# EAGLE design Sun Trcker (EAGLE 9.6.2)
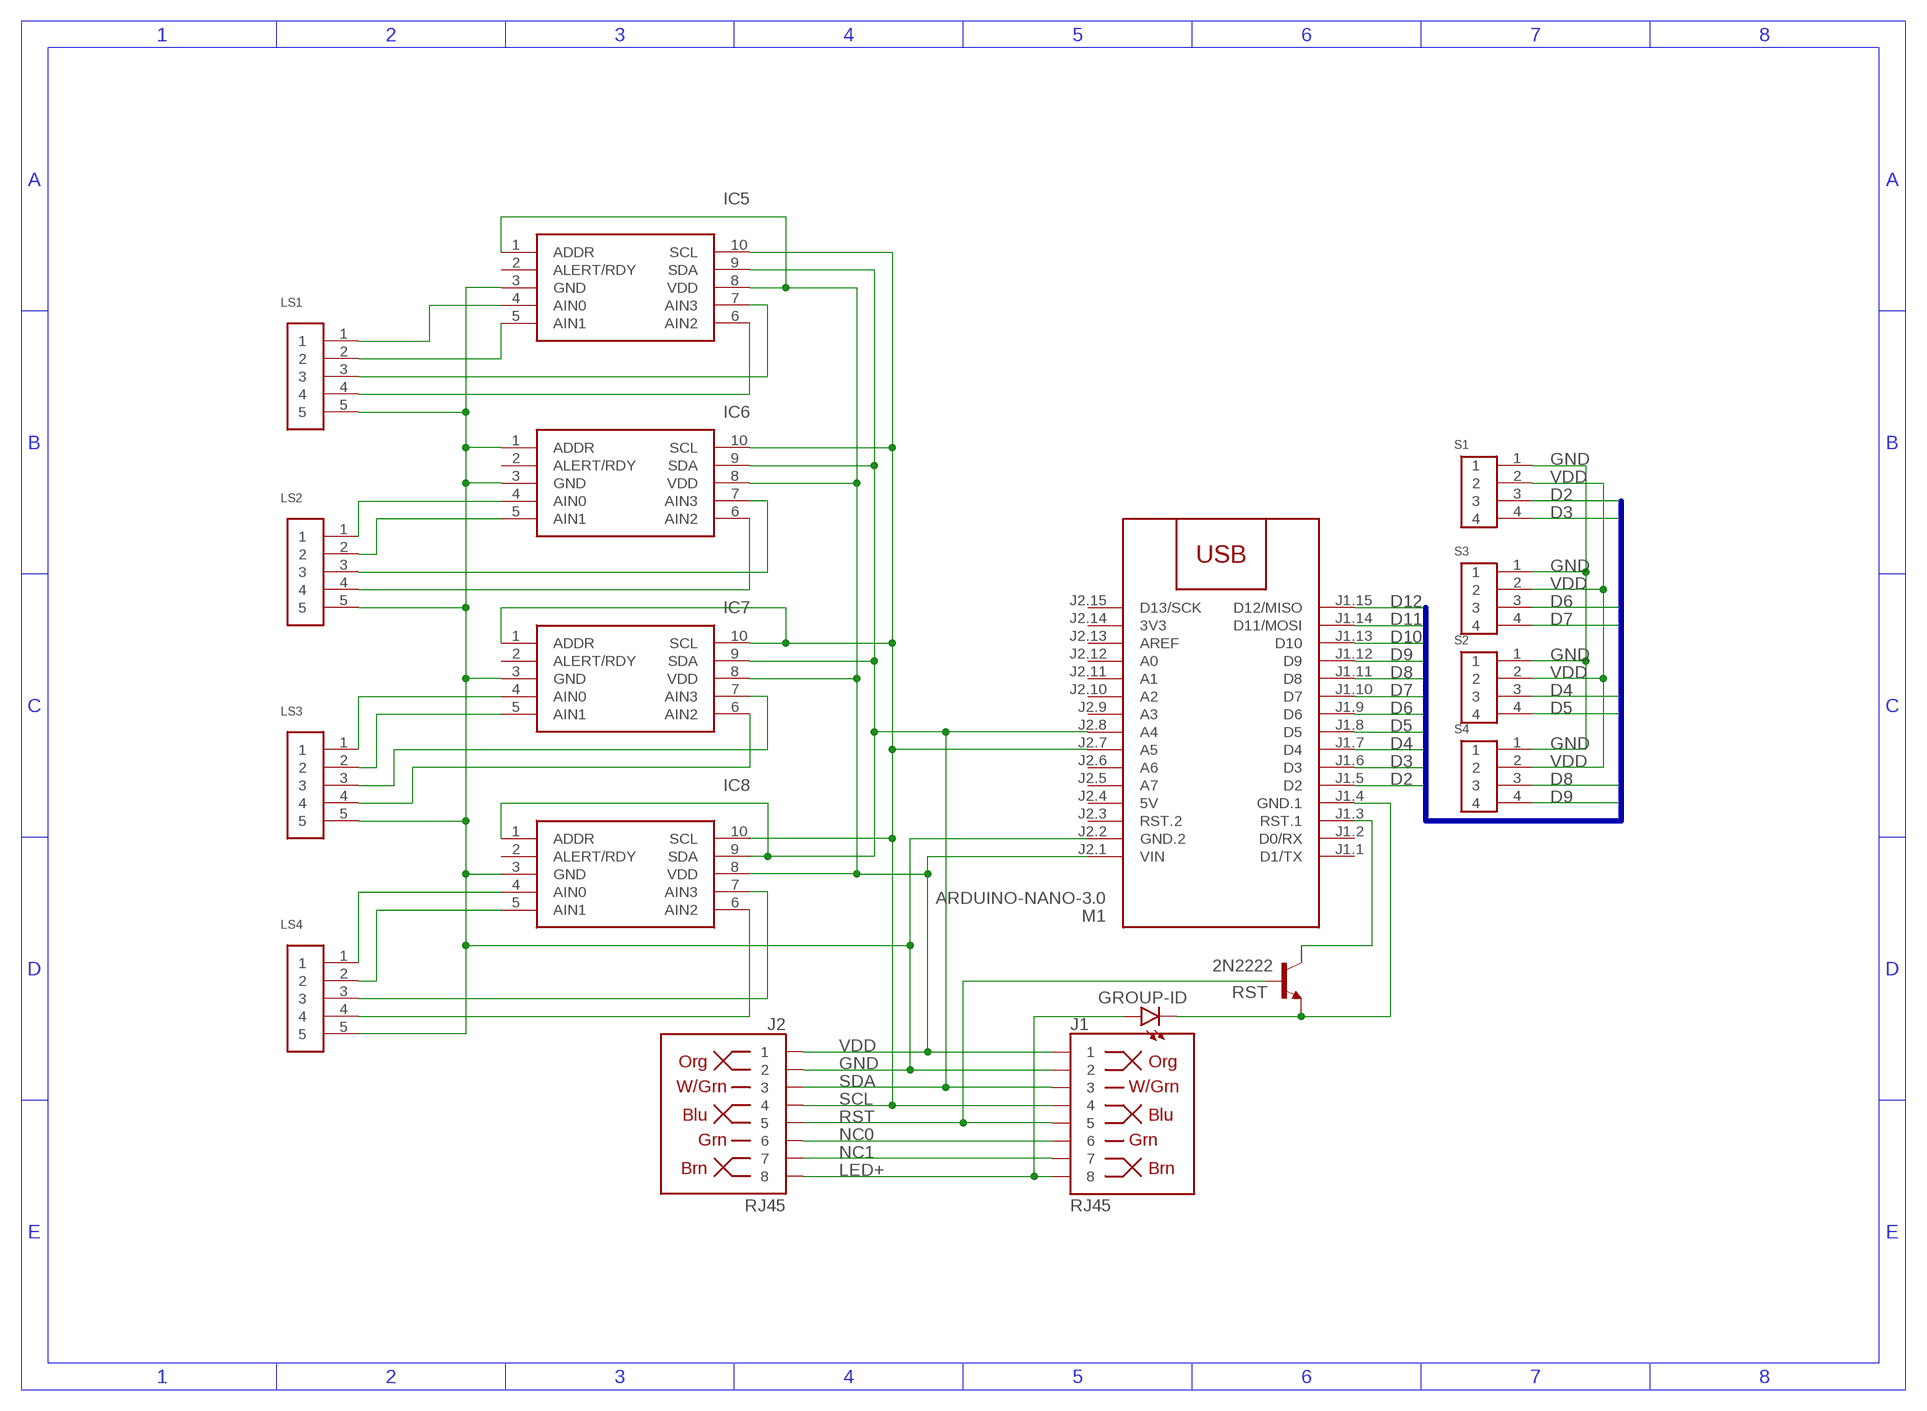
[diagram p0: schematic, sheet 1]

## Parts
GROUP-ID  LED_BLUE  LED_RADIAL_BLUE  [LEDRD254W60D565H860B_B]
IC5  ADS1115IDGST  [SOP50P490X110-10N]
IC6  ADS1115IDGST  [SOP50P490X110-10N]
IC7  ADS1115IDGST  [SOP50P490X110-10N]
IC8  ADS1115IDGST  [SOP50P490X110-10N]
J1  RJ45  RJ45-8  [RJ45-8]
J2  RJ45  RJ45-8  [RJ45-8]
LS1  S5B-EH(LF)(SN)  [S5B-EH(LF)(SN)]
LS2  S5B-EH(LF)(SN)  [S5B-EH(LF)(SN)]
LS3  S5B-EH(LF)(SN)  [S5B-EH(LF)(SN)]
LS4  S5B-EH(LF)(SN)  [S5B-EH(LF)(SN)]
M1  ARDUINO-NANO-3.0  [ARDUINO-NANO-3.0]
RST  2N2222  [TO18]
S1  B4B-XH-A(LF)(SN)  [B4B-XH-A(LF)(SN)]
S2  B4B-XH-A(LF)(SN)  [B4B-XH-A(LF)(SN)]
S3  B4B-XH-A(LF)(SN)  [B4B-XH-A(LF)(SN)]
S4  B4B-XH-A(LF)(SN)  [B4B-XH-A(LF)(SN)]

## Nets
D2: M1.J1.5(D2) S1.3
D3: M1.J1.6(D3) S1.4
D4: M1.J1.7(D4) S2.3
D5: M1.J1.8(D5) S2.4
D6: M1.J1.9(D6) S3.3
D7: M1.J1.10(D7) S3.4
D8: M1.J1.11(D8) S4.3
D9: M1.J1.12(D9) S4.4
D10: M1.J1.13(D10)
D11: M1.J1.14(D11/MOSI)
D12: M1.J1.15(D12/MISO)
GND: IC5.3(GND) IC6.1(ADDR) IC6.3(GND) IC7.3(GND) IC8.3(GND) J1.2 J2.2 LS1.5 LS2.5 LS3.5 LS4.5 M1.J2.2(GND.2) S1.1 S2.1 S3.1 S4.1
LED+: GROUP-ID.1(A) J1.8 J2.8
N$7: IC5.4(AIN0) LS1.1
N$8: IC5.5(AIN1) LS1.2
N$9: IC5.7(AIN3) LS1.3
N$10: IC5.6(AIN2) LS1.4
N$11: GROUP-ID.2(C) M1.J1.4(GND.1) RST.1(E)
N$16: IC6.4(AIN0) LS2.1
N$21: M1.J1.3(RST.1) RST.3(C)
N$53: IC6.5(AIN1) LS2.2
N$68: IC6.7(AIN3) LS2.3
N$69: IC6.6(AIN2) LS2.4
N$70: IC7.4(AIN0) LS3.1
N$71: IC7.5(AIN1) LS3.2
N$72: IC7.7(AIN3) LS3.3
N$73: IC7.6(AIN2) LS3.4
N$74: IC8.4(AIN0) LS4.1
N$75: IC8.5(AIN1) LS4.2
N$76: IC8.7(AIN3) LS4.3
N$77: IC8.6(AIN2) LS4.4
NC0: J1.6 J2.6
NC1: J1.7 J2.7
RST: J1.5 J2.5 RST.2(B)
SCL: IC5.10(SCL) IC6.10(SCL) IC7.1(ADDR) IC7.10(SCL) IC8.10(SCL) J1.4 J2.4 M1.J2.7(A5)
SDA: IC5.9(SDA) IC6.9(SDA) IC7.9(SDA) IC8.1(ADDR) IC8.9(SDA) J1.3 J2.3 M1.J2.8(A4)
VDD: IC5.1(ADDR) IC5.8(VDD) IC6.8(VDD) IC7.8(VDD) IC8.8(VDD) J1.1 J2.1 M1.J2.1(VIN) S1.2 S2.2 S3.2 S4.2
Unconnected: IC5.2(ALERT/RDY) IC6.2(ALERT/RDY) IC7.2(ALERT/RDY) IC8.2(ALERT/RDY) M1.J1.1(D1/TX) M1.J1.2(D0/RX) M1.J2.3(RST.2) M1.J2.5(A7) M1.J2.6(A6) M1.J2.9(A3) M1.J2.10(A2) M1.J2.11(A1) M1.J2.12(A0) M1.J2.13(AREF) M1.J2.15(D13/SCK)

## Buses
D2,D3,D4,D5,D6,D7,D8,D9,D10,D11,D12

## Power pins joined to a net without a drawn wire
3V3: M1.J2.14(3V3)
5V: M1.J2.4(5V)

## Library data of the parts
GROUP-ID = Opto-Electronic:LED_RADIAL: LED - Generic; CATEGORY: Opto-Electronic; SUB-CATEGORY: LED
IC5-IC8 = ADS1115IDGST:ADS1115IDGST: 16-Bit, 860SPS, 4-Ch Delta-Sigma ADC w/ PGA, Oscillator, Voltage Reference, Comparator & I2C Source: Datasheet <https://datasheet.datasheetarchive.com/originals/distributors/Datasheets-SFU2/DSASFU100025989.pdf>; ARROW_PART_NUMBER: ADS1115IDGST; ARROW_PRICE-STOCK: https://www.arrow.com/en/products/ads1115idgst/texas-instruments?region=nac; DESCRIPTION: 16-Bit, 860SPS, 4-Ch Delta-Sigma ADC w/ PGA, Oscillator, Voltage Reference, Comparator & I2C; HEIGHT: 1.1mm; MANUFACTURER_NAME: Texas Instruments; MANUFACTURER_PART_NUMBER: ADS1115IDGST; MOUSER_PART_NUMBER: 595-ADS1115IDGST; MOUSER_PRICE-STOCK: https://www.mouser.co.uk/ProductDetail/Texas-Instruments/ADS1115IDGST?qs=6805eV47HhY3JIwOhQ2zog%3D%3D
J1 J2 = SparkFun-Connectors:RJ45-8: RJ45 Jack - 8 pin Simple RJ45, 8-pin connection. Commonly used for Cat5, Cat5e, and Cat6 Ethernet cables. Here is the connector we sell at SparkFun: RJ45 8-Pin Connector <https://www.sparkfun.com/products/643> (PRT-00643) Datasheet <https://cdn.sparkfun.com/datasheets/Prototyping/04908.pdf> It is used on this SparkFun product: SparkFun RJ45 Breakout <https://www.sparkfun.com/products/716> (BOB-00716) Note, you may also be interested in the "MAGJACK" version of this. It is basically a RJ45 connector, but also has some status LEDs built into the connector housing. You can check that out in this library at the device named "MAGJACK.dev" and see these products online: RJ45 Ethernet MagJack-Compatible <https://www.sparkfun.com/products/8534> (PRT-08534) SparkFun RJ45 MagJack Breakout <https://www.sparkfun.com/products/13021> (BOB-13021); PROD_ID: CONN-08506; SF_ID: PRT-00643
LS1-LS4 = Headers:S5B-EH(LF)(SN): CONN HEADER R/A 5POS 2.5MM Manufacturer's datasheet <http://www.jst-mfg.com/product/pdf/eng/eEH.pdf>; CREATED_BY: PCBLayout.com; DIGIKEY_PARTNO: 455-1628-ND; MANUFACTURER: JST Sales America Inc.; MPN: S5B-EH(LF)(SN)
M1 = diy-modules:ARDUINO-NANO-3.0: Arduino Nano 3.0 and compatible devices More details available here: https://www.arduino.cc/en/Main/ArduinoBoardNano Click here to find device on ebay.com <http://www.ebay.com/sch/arduino+nano>
RST = transistor:2N2222: NPN TRANSISTOR
S1-S4 = Headers:B4B-XH-A(LF)(SN): CONN HEADER VERT 4POS 2.5MM Manufacturer's datasheet <http://www.jst-mfg.com/product/pdf/eng/eXH.pdf>; CREATED_BY: PCBLayout.com; DIGIKEY_PARTNO: 455-2249-ND; MANUFACTURER: JST Sales America Inc.; MPN: B4B-XH-A(LF)(SN)

## Board
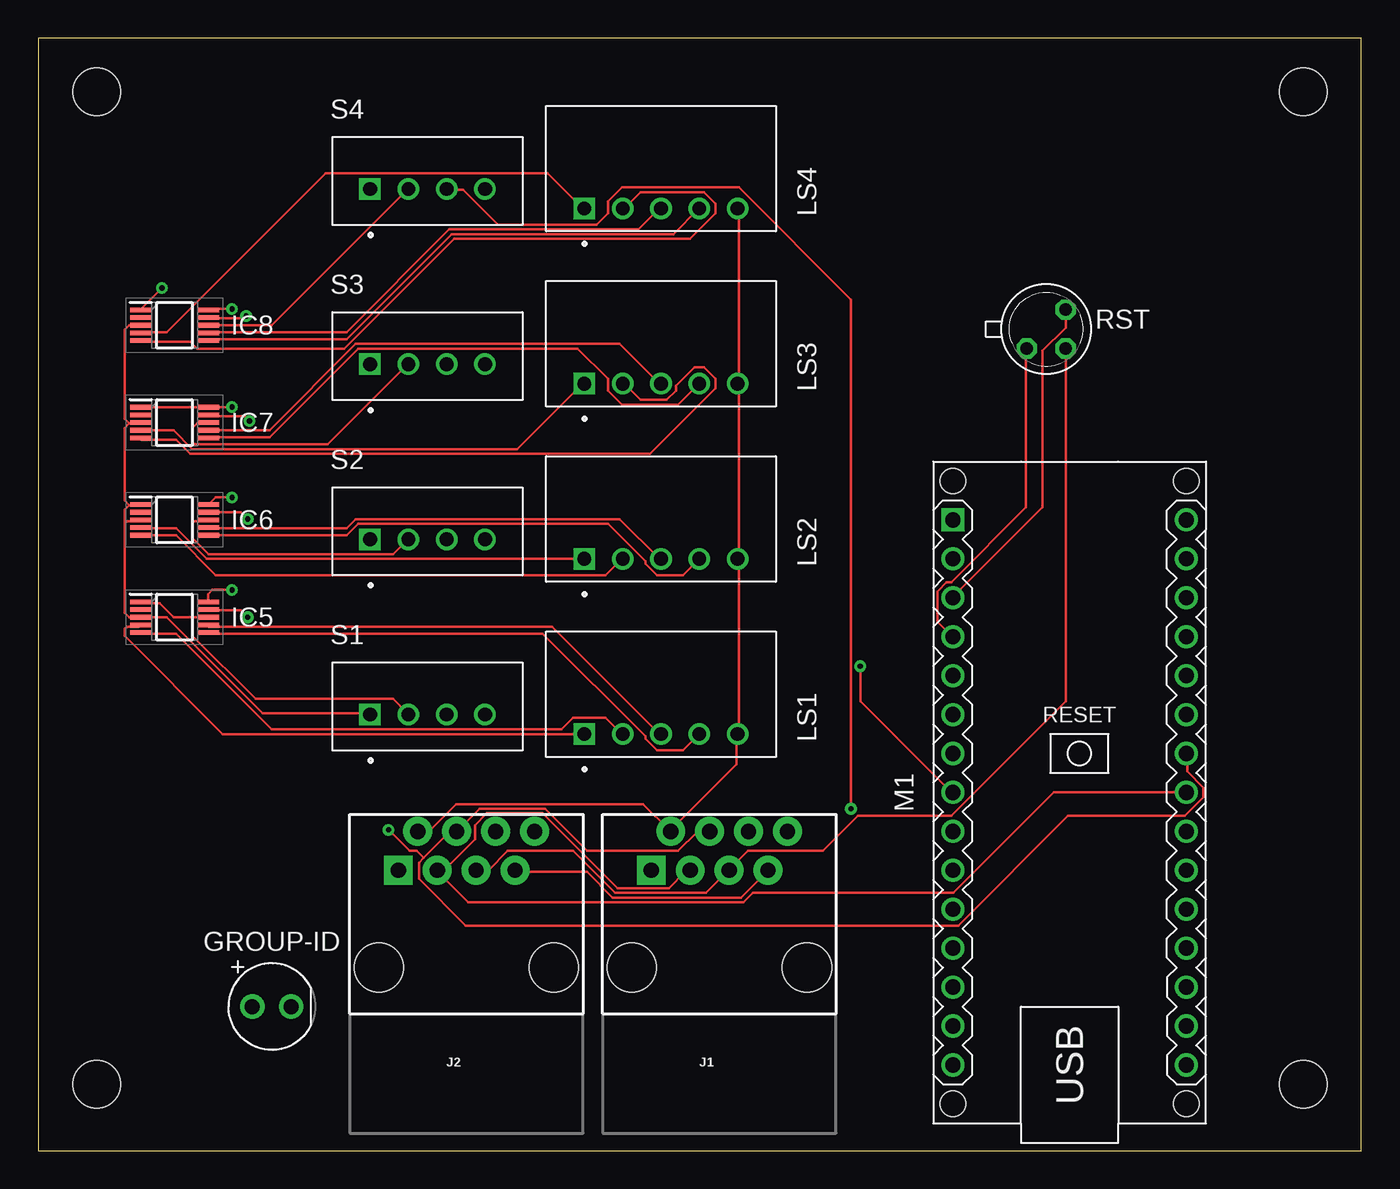
[diagram p1: board, top side]
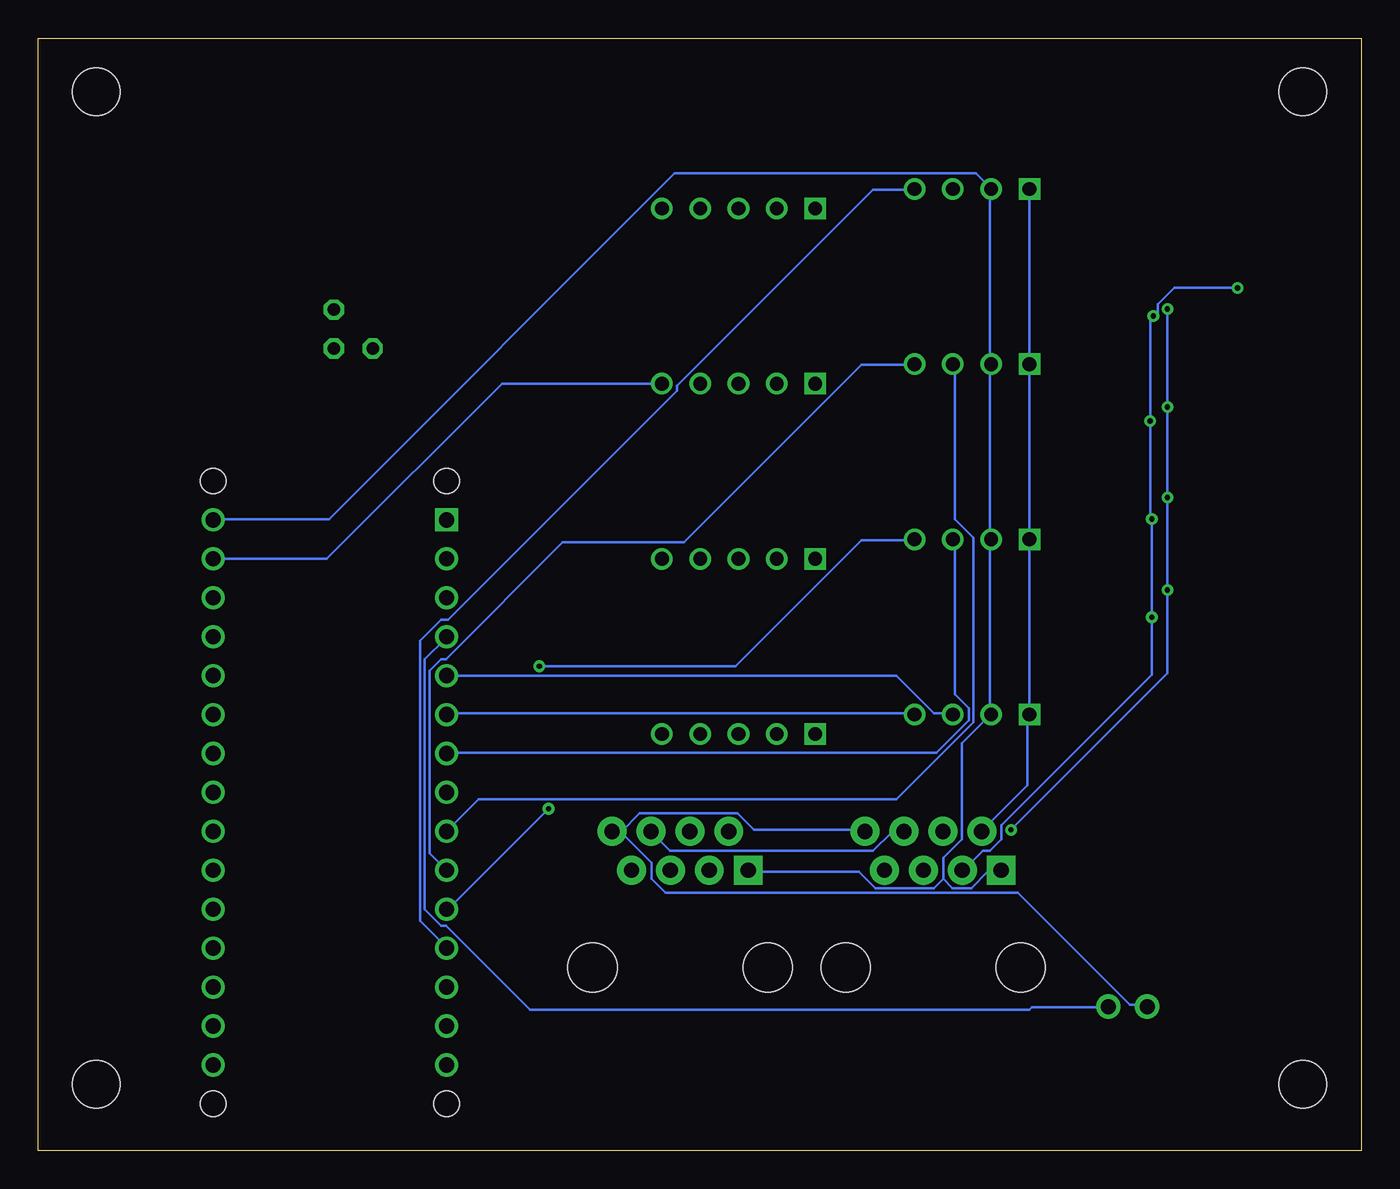
[diagram p2: board, bottom side, seen from below]

Size 86.34 x 72.57 mm. Coordinates in mm from the lower left corner, seen from the top.
Outline: 0,0 86.34,0 86.34,72.57 0,72.57 0,0
Copper layers (1*16): Top 0.035mm / dielectric 0.15mm / Bottom 0.035mm
Design rules "default": minimum track width 6mil, minimum drill 0.35mm, track to track 6mil, track to pad 6mil, pad to pad 6mil, via to via 6mil, smd to smd 6mil, copper to edge 40mil, drill to drill 6mil, minimum pad ring 10mil, minimum via ring 8mil, stop-mask expansion 4mil, vias tented up to drill 0mil, thermal gap 10mil
Holes 3.1 mm at 3.81,69.09 3.81,4.32 82.55,4.32 82.55,69.09
vRestrict: area 5.6,51.8 to 12.2,55.9; area 5.6,45.7 to 12.2,49.3; area 5.6,39.1 to 12.2,43.2; area 5.6,33 to 12.2,36.6; area 19.3,48.8 to 32,54.9; area 19.3,37.1 to 31.5,43.7; area 18.8,25.9 to 31.5,32; area 33,25.9 to 47.8,34; area 33,37.1 to 48.3,45.7; area 33,48.3 to 48.3,56.9; area 33,59.9 to 48.8,68.6; area 18.8,60.5 to 32,66.5

### Footprints (pad centres in the part's own frame; a part is rotated, then mirrored left to right if it is on the bottom)
LEDRD254W60D565H860B_B = drill 0.981 pad 1.581: 1 -1.27,0; 2 1.27,0
SOP50P490X110-10N = smd 1.4 x 0.3: 1 -2.2,1; 2 -2.2,0.5; 3 -2.2,0; 4 -2.2,-0.5; 5 -2.2,-1; 6 2.2,-1; 7 2.2,-0.5; 8 2.2,0; 9 2.2,0.5; 10 2.2,1
RJ45-8 = drill 1 pad 1.88 square: 1 -4.445,6.35 | drill 1 pad 1.88: 2 -3.175,8.89; 3 -1.905,6.35; 4 -0.635,8.89; 5 0.635,6.35; 6 1.905,8.89; 7 3.175,6.35; 8 4.445,8.89 | hole 3.2: -5.715,0; 5.715,0
S5B-EH(LF)(SN) = drill 0.9 square: 1 -5,0 | drill 0.9: 2 -2.5,0; 3 0,0; 4 2.5,0; 5 5,0
ARDUINO-NANO-3.0 = drill 1 square: J1.1 17.78,7.62 | drill 1: J1.2 15.24,7.62; J1.3 12.7,7.62; J1.4 10.16,7.62; J1.5 7.62,7.62; J1.6 5.08,7.62; J1.7 2.54,7.62; J1.8 0,7.62; J1.9 -2.54,7.62; J1.10 -5.08,7.62; J1.11 -7.62,7.62; J1.12 -10.16,7.62; J1.13 -12.7,7.62; J1.14 -15.24,7.62; J1.15 -17.78,7.62; J2.1 17.78,-7.62; J2.2 15.24,-7.62; J2.3 12.7,-7.62; J2.4 10.16,-7.62; J2.5 7.62,-7.62; J2.6 5.08,-7.62; J2.7 2.54,-7.62; J2.8 0,-7.62; J2.9 -2.54,-7.62; J2.10 -5.08,-7.62; J2.11 -7.62,-7.62; J2.12 -10.16,-7.62; J2.13 -12.7,-7.62; J2.14 -15.24,-7.62; J2.15 -17.78,-7.62 | hole 1.651: -20.32,7.62; -20.32,-7.62; 20.32,-7.62; 20.32,7.62
TO18 = drill 0.813 octagon: 1 -1.27,-1.27; 2 1.27,-1.27; 3 1.27,1.27
B4B-XH-A(LF)(SN) = drill 0.9 square: 1 -3.75,0 | drill 0.9: 2 -1.25,0; 3 1.25,0; 4 3.75,0

### Placement (x,y rotation side)
GROUP-ID  15.24,9.4 0 top
IC5  8.89,34.8 0 top
IC6  8.89,41.15 0 top
IC7  8.89,47.5 0 top
IC8  8.89,53.85 0 top
J1  44.45,11.94 0 top
J2  27.94,11.94 0 top
LS1  40.64,27.18 0 top
LS2  40.64,38.61 0 top
LS3  40.64,50.04 0 top
LS4  40.64,61.47 0 top
M1  67.31,23.37 90 top
RST  65.79,53.59 0 top
S1  25.4,28.45 0 top
S2  25.4,39.88 0 top
S3  25.4,51.31 0 top
S4  25.4,62.74 0 top

### Tracks (layer width: path | path; a pad name or v marks a point on that pad's centre or on a via)
D2
  Bottom 0.152: M1.J1.5 30.33,30.99 27.89,28.55 26.67,28.55 S1.3
D3
  Bottom 0.152: S1.4 29.26,28.55 59.59,28.55 M1.J1.6
D4
  Bottom 0.152: S2.3 26.52,39.83 26.52,29.77 25.6,28.85 25.6,28.09 27.74,25.96 59.59,25.96 M1.J1.7
D5  (via drill 0.35)
  Top 0.152: v53.65,31.6 53.65,29.31 59.59,23.37 M1.J1.8
  Bottom 0.152: v53.65,31.6 40.84,31.6 32.61,39.83 29.26,39.83 S2.4
D6
  Bottom 0.152: M1.J1.9 57.61,22.91 30.33,22.91 25.3,27.94 25.3,39.98 26.52,41.2 26.52,51.26 S3.3
D7
  Bottom 0.152: M1.J1.10 60.81,19.41 60.81,31.29 60.05,32.05 59.74,32.05 52.12,39.68 44.2,39.68 32.61,51.26 29.26,51.26 S3.4
D8  (via drill 0.35)
  Top 0.152: v53.03,22.3 53.03,55.52 45.72,62.84 38.1,62.84 37.19,61.93 37.19,61.16 36.42,60.4 30.02,60.4 27.74,62.69 26.67,62.69 S4.3
  Bottom 0.152: v53.03,22.3 59.59,15.75 M1.J1.11
D9
  Bottom 0.152: S4.4 29.26,62.69 31.85,62.69 44.65,49.89 44.65,49.58 59.59,34.65 60.05,34.65 61.42,33.27 61.42,14.99 59.74,13.31 M1.J1.12
GND
  Top 0.152: 5.64,40.89 5.64,35.1 5.94,34.8 IC5.3 8.38,34.8 14.63,28.55 21.64,28.55 S1.1 | 5.64,40.89 5.79,41.05 6.55,41.05 IC6.3 | 5.94,42.11 6.55,42.11 IC6.1 | 5.94,42.11 5.64,41.81 5.64,40.89 | 5.94,47.45 6.55,47.45 IC7.3 | 5.94,47.45 5.64,47.14 5.64,42.42 5.94,42.11 | IC8.3 5.94,53.85 5.64,53.54 5.64,47.75 5.94,47.45 | 45.72,50.04 45.72,38.61 | 45.72,50.04 45.72,61.47 LS4.5 | 45.72,50.04 LS3.5 | 45.72,38.61 45.72,27.18 LS1.5 45.57,27.18 45.57,25.2 41.3,20.93 J1.2 41.15,20.93 39.47,22.61 27.28,22.61 25.6,20.93 24.84,20.93 J2.2 | 45.72,38.61 LS2.5
  Bottom 0.152: J2.2 24.69,20.93 21.79,23.82 21.79,28.4 S1.1 21.64,28.55 21.64,39.83 S2.1 21.64,39.98 21.64,51.26 S3.1 21.64,51.41 21.64,62.69 S4.1 | M1.J2.2 67.51,38.61 56.08,50.04 LS3.5
LED+
  Bottom 0.152: 48.31,20.78 46.33,18.8 46.33,17.73 45.41,16.81 22.4,16.81 15.09,9.5 14.02,9.5 GROUP-ID.1 | 48.31,20.78 48.77,20.78 J1.8 48.31,20.78 | 48.31,20.78 47.09,22 40.69,22 39.62,20.93 32.46,20.93 J2.8
N$7
  Top 0.152: LS1.1 12.04,27.18 5.64,33.58 5.64,34.04 5.79,34.19 6.55,34.19 IC5.4
N$8
  Top 0.152: IC5.5 6.71,33.73 8.99,33.73 15.24,27.48 34.14,27.48 34.9,28.24 37.03,28.24 38.1,27.18 LS1.2
N$9
  Top 0.152: IC5.7 11.12,34.19 33.53,34.19 40.54,27.18 LS1.3
N$10
  Top 0.152: IC5.6 11.12,33.73 32.92,33.73 39.62,27.03 39.62,26.87 40.39,26.11 42.06,26.11 43.13,27.18 LS1.4
N$11
  Top 0.152: RST.1 64.47,52.32 64.47,41.96 59.59,37.08 59.28,37.08 58.67,36.47 58.67,34.49 59.59,33.58 M1.J1.4
  Bottom 0.152: GROUP-ID.2 16.61,9.35 21.49,9.35 21.64,9.2 54.25,9.2 59.74,14.68 60.05,14.68 61.11,15.75 61.11,32.05 59.74,33.43 M1.J1.4
N$16
  Top 0.152: LS2.1 10.97,38.61 8.99,40.59 6.71,40.59 IC6.4
N$21
  Top 0.152: RST.3 67.06,53.7 65.53,52.17 65.53,41.96 59.74,36.17 M1.J1.3
N$53
  Top 0.152: IC6.5 6.71,40.13 8.99,40.13 11.58,37.54 37.03,37.54 38.1,38.61 LS2.2
N$68
  Top 0.152: IC6.7 11.12,40.59 20.12,40.59 20.73,41.2 37.95,41.2 40.54,38.61 LS2.3
N$69
  Top 0.152: IC6.6 11.12,40.13 20.12,40.13 20.88,40.89 37.19,40.89 39.62,38.46 39.62,38.3 40.39,37.54 42.06,37.54 43.13,38.61 LS2.4
N$70
  Top 0.152: IC7.4 6.71,46.99 8.84,46.99 10.06,45.77 31.24,45.77 35.51,50.04 LS3.1
N$71
  Top 0.152: IC7.5 6.71,46.38 8.99,46.38 9.91,45.47 39.93,45.47 44.2,49.73 44.2,50.34 43.43,51.11 42.82,51.11 41.6,49.89 41.6,49.58 41,48.97 39.32,48.97 38.25,50.04 LS3.2
N$72
  Top 0.152: IC7.7 11.12,46.99 15.09,46.99 20.73,52.63 37.95,52.63 40.54,50.04 LS3.3
N$73
  Top 0.152: IC7.6 11.12,46.53 15.09,46.53 20.88,52.32 35.2,52.32 37.19,50.34 37.19,49.58 38.1,48.67 41.76,48.67 43.13,50.04 LS3.4
N$74
  Top 0.152: IC8.4 6.71,53.39 8.38,53.39 18.75,63.75 33.22,63.75 35.51,61.47 LS4.1
N$75
  Top 0.152: IC8.5 6.71,52.78 9.91,52.78 10.36,52.32 19.96,52.32 27.13,59.49 42.52,59.49 44.2,61.16 44.2,61.77 43.43,62.54 39.32,62.54 38.25,61.47 LS4.2
N$76
  Top 0.152: IC8.7 11.12,53.39 20.12,53.39 26.82,60.1 39.17,60.1 40.54,61.47 LS4.3
N$77
  Top 0.152: IC8.6 11.12,52.93 20.12,52.93 26.98,59.79 41.45,59.79 43.13,61.47 LS4.4
NC0
  Bottom 0.152: J2.6 29.87,20.78 30.63,20.78 31.85,19.56 45.11,19.56 46.33,20.78 J1.6
NC1
  Top 0.152: J2.7 31.24,18.19 35.81,18.19 37.49,16.51 45.87,16.51 47.55,18.19 J1.7
RST
  Top 0.152: RST.2 67.06,29.31 59.59,21.84 53.49,21.84 51.21,19.56 46.33,19.56 45.11,18.34 J1.5 44.96,18.19 43.59,16.81 37.64,16.81 34.9,19.56 30.63,19.56 29.41,18.34 28.65,18.34 J2.5
SCL  (via drill 0.35)
  Top 0.152: IC7.1 6.71,48.51 10.97,48.51 IC7.10 11.12,48.51 v12.65,48.51 | IC5.10 11.09,36.31 11.36,36.58 v12.65,36.58 | IC6.10 11.56,42.62 v12.65,42.62 | v12.65,54.91 11.12,54.91 IC8.10 | 25.15,19.1 26.82,20.78 27.28,20.78 J2.4 27.43,20.93 28.8,22.3 33.07,22.3 35.81,19.56 41.76,19.56 42.98,20.78 43.74,20.78 J1.4 | 25.15,19.1 24.84,18.8 24.84,17.73 27.89,14.68 60.05,14.68 67.21,21.84 74.83,21.84 76.05,23.06 76.05,23.67 74.98,24.74 74.98,25.81 M1.J2.7 | v22.86,20.93 24.23,19.56 24.69,19.56 25.15,19.1
  Bottom 0.152: v12.65,54.91 v12.65,48.51 v12.65,42.62 v12.65,36.58 12.65,31.14 v22.86,20.93
SDA  (via drill 0.35)
  Top 0.152: v13.66,34.8 13.21,35.26 11.12,35.26 IC5.9 | v13.66,41.2 13.21,41.66 11.12,41.66 IC6.9 | v13.77,47.6 13.46,47.9 11.12,47.9 IC7.9 | v8.08,56.29 6.71,54.91 IC8.1 | v13.56,54.46 13.41,54.3 11.12,54.3 IC8.9 | M1.J2.8 66.29,23.37 59.74,16.81 46.63,16.81 46.02,16.2 28.04,16.2 26.21,18.03 | 26.21,18.03 26.06,18.19 J2.3 26.21,18.03 | 26.21,18.03 28.5,20.32 28.5,21.23 29.26,22 32.92,22 37.8,17.12 41.15,17.12 42.22,18.19 42.52,18.19 J1.3
  Bottom 0.152: J2.3 25.91,18.34 24.69,19.56 24.23,19.56 23.47,20.32 23.47,21.23 13.66,31.04 v13.66,34.8 v13.66,41.2 13.77,41.3 v13.77,47.6 13.77,54.25 v13.56,54.46 13.26,54.46 13.26,55.22 12.19,56.29 v8.08,56.29
VDD
  Top 0.152: 10.06,34.8 8.84,34.8 7.92,35.71 6.71,35.71 IC5.1 | 10.06,34.8 IC5.8 | IC6.8 10.97,41.05 10.21,41.05 10.06,40.89 10.06,39.98 11.12,38.91 23.16,38.91 24.08,39.83 S2.2 | 10.06,34.8 10.06,33.58 14.17,29.46 23.16,29.46 24.08,28.55 S1.2 | IC7.8 10.97,47.45 10.36,47.45 10.06,47.14 10.06,46.23 10.21,46.08 18.9,46.08 24.08,51.26 S3.2 | IC8.8 15.24,53.85 24.08,62.69 S4.2
  Bottom 0.152: 27.28,17.73 26.67,17.12 25.45,17.12 24.38,18.19 23.62,18.19 J2.1 | 27.28,17.73 27.28,19.1 26.06,20.32 26.06,26.57 24.23,28.4 S1.2 24.23,28.55 24.23,39.83 S2.2 24.23,39.98 24.23,51.26 S3.2 24.23,51.41 24.23,62.69 S4.2 24.23,62.84 25.15,63.75 44.81,63.75 67.36,41.2 74.83,41.2 M1.J2.1 | 27.28,17.73 27.89,17.12 31.7,17.12 32.77,18.19 39.93,18.19 J1.1